# EAGLE design bleumaus-oshchip-mk-1.0.0 (EAGLE 9.3.1)
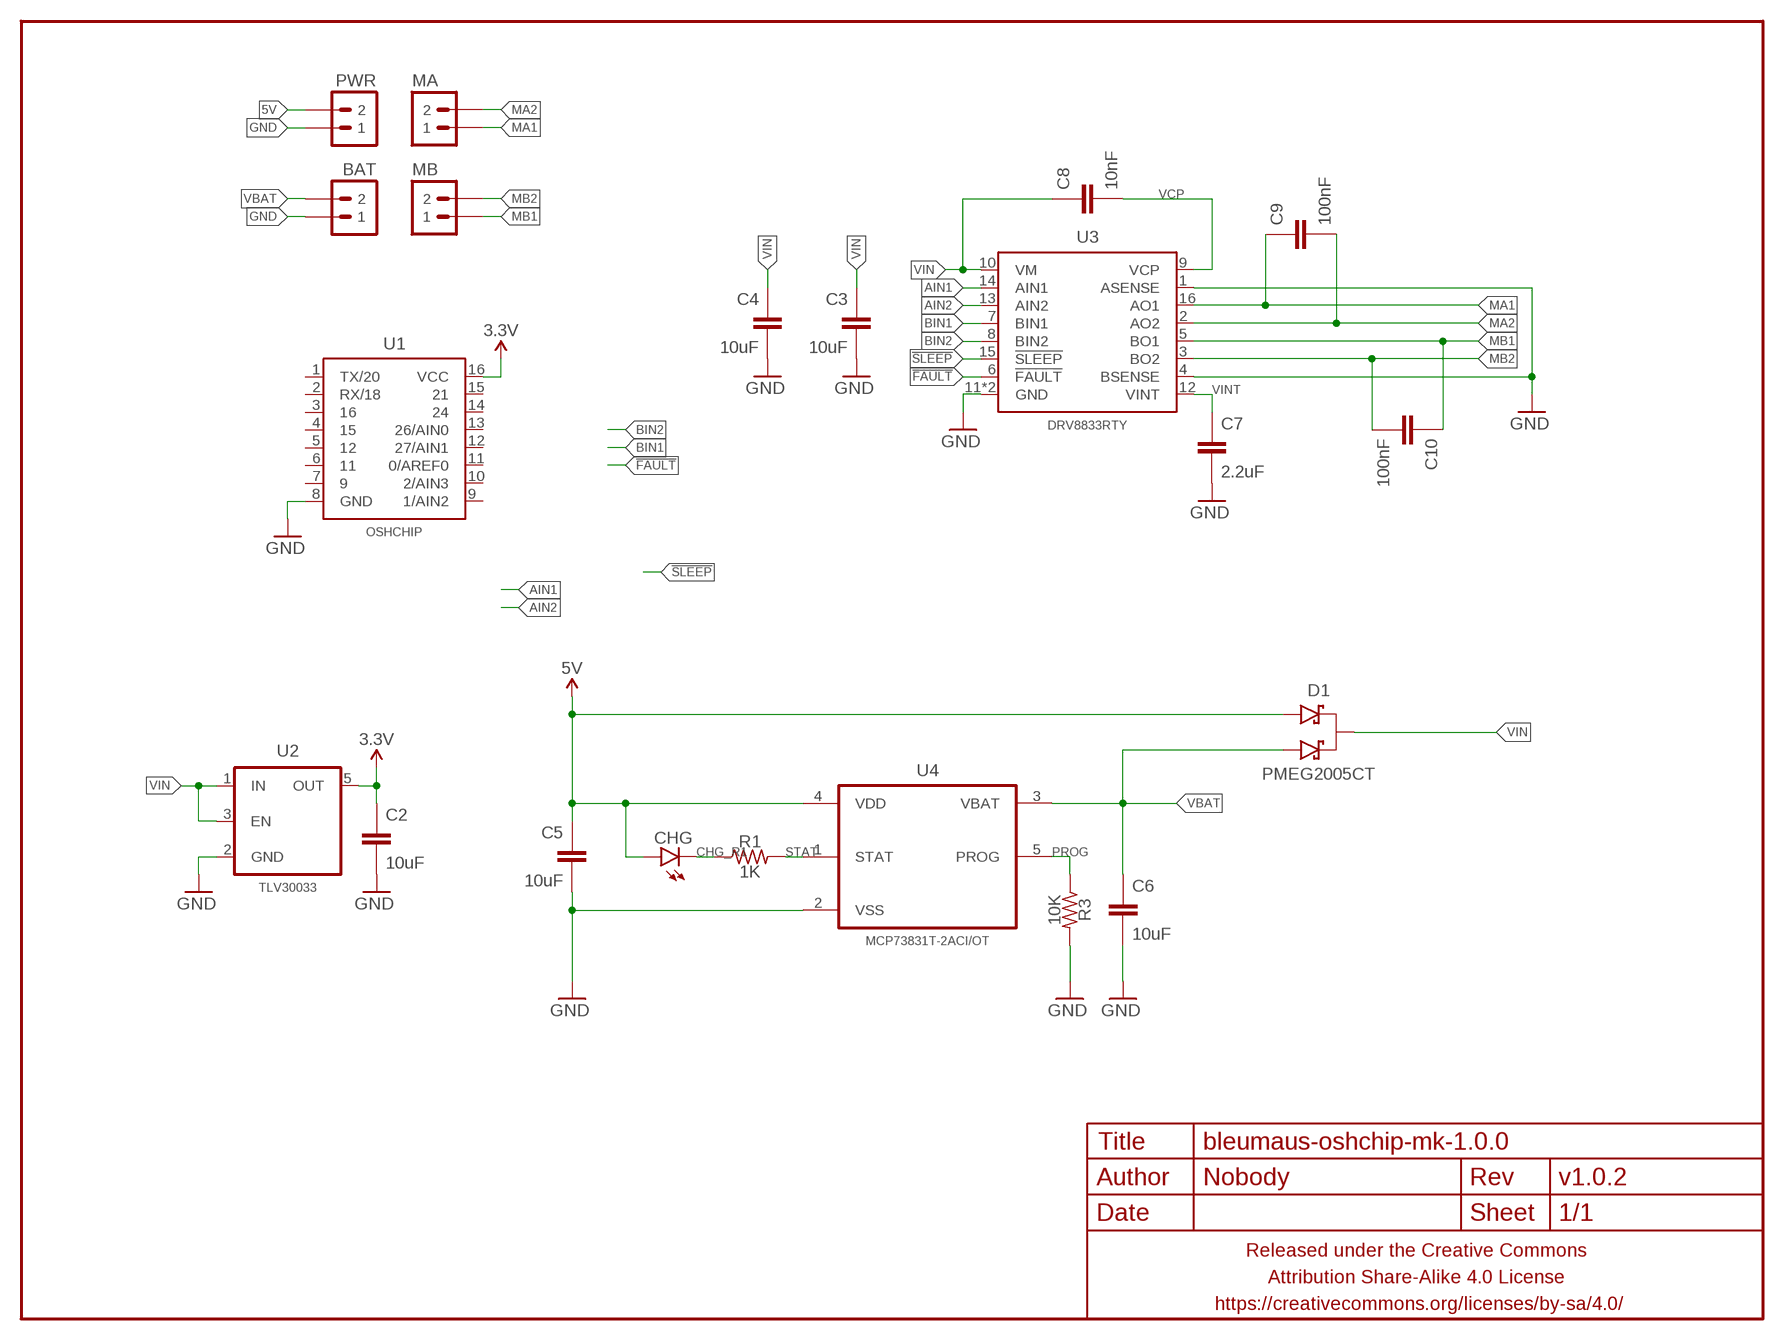
[diagram p0: schematic, sheet 1]

## Parts
BAT  M02PTH-2MM  [1X02-2MM-PTH]
C2  10uF  CAPACITOR-CERAMICC0402  [C0402]
C3  10uF  CAPACITOR-CERAMICC1206  [C1206]
C4  10uF  CAPACITOR-CERAMICC1206  [C1206]
C5  10uF  CAPACITOR-CERAMICC0402  [C0402]
C6  10uF  CAPACITOR-CERAMICC0402  [C0402]
C7  2.2uF  CAPACITOR-CERAMICC0402  [C0402]
C8  10nF  CAPACITOR-CERAMICC0402  [C0402]
C9  100nF  CAPACITOR-CERAMICC0402  [C0402]
C10  100nF  CAPACITOR-CERAMICC0402  [C0402]
CHG  LED0603-TIGHT  [LED-0603-TIGHT]
D1  PMEG2005CT  DIODE-SCHOTTKY-DUALPMEG2005CT  [SOT23]
FRAME1  FRAME-LETTERNO_PACKAGE  [DUMMY]
MA  M02PTH-2MM  [1X02-2MM-PTH]
MB  M02PTH-2MM  [1X02-2MM-PTH]
PWR  M02PTH-2MM  [1X02-2MM-PTH]
R1  1K  RESISTORR0402  [R0402]
R3  10K  RESISTORR0402  [R0402]
U1  OSHCHIP  [DIL16]
U2  TLV30033  V_REG_ENTLV700XXDCK-TIGHTER  [SC70-TIGHTER]
U3  DRV8833RTY  [PWQFN-16]
U4  MCP73831T-2ACI/OT  [SOT95P280X145-5N]

## Nets
3.3V: C2.1 U1.16(VCC) U2.5(OUT)
5V: C5.1 CHG.A D1.1(A1) PWR.P$2 U4.4(VDD)
!FAULT: U3.6(!FAULT)
!SLEEP: U3.15(!SLEEP)
AIN1: U3.14(AIN1)
AIN2: U3.13(AIN2)
BIN1: U3.7(BIN1)
BIN2: U3.8(BIN2)
CHG_R1: CHG.C R1.1
GND: BAT.P$1 C2.2 C3.2 C4.2 C5.2 C6.2 C7.2 PWR.P$1 R3.2 U1.8(GND) U2.2(GND) U3.1(ASENSE) U3.4(BSENSE) U3.11(GND) U3.17(GND) U4.2(VSS)
MA1: C9.1 MA.P$1 U3.16(AO1)
MA2: C9.2 MA.P$2 U3.2(AO2)
MB1: C10.1 MB.P$1 U3.5(BO1)
MB2: C10.2 MB.P$2 U3.3(BO2)
PROG: R3.1 U4.5(PROG)
STAT: R1.2 U4.1(STAT)
VBAT: BAT.P$2 C6.1 D1.2(A2) U4.3(VBAT)
VCP: C8.2 U3.9(VCP)
VIN: C3.1 C4.1 C8.1 D1.3(K) U2.1(IN) U2.3(EN) U3.10(VM)
VINT: C7.1 U3.12(VINT)
Unconnected: U1.1(TX/20) U1.2(RX/18) U1.3 U1.4 U1.5 U1.6 U1.7 U1.9(1/AIN2) U1.10(2/AIN3) U1.11(0/AREF0) U1.12(27/AIN1) U1.13(26/AIN0) U1.14 U1.15

## Library data of the parts
BAT MA MB PWR = a_parts:M02: Standard 2-pin 0.1" header. Use with - straight break away headers ( PRT-00116) - right angle break away headers (PRT-00553) - swiss pins (PRT-00743) - machine pins (PRT-00117) - female headers (PRT-00115) Molex polarized connector foot print use with: PRT-08233 with associated crimp pins and housings. 2.54_SCREWTERM for use with PRT-10571. 3.5mm Screw Terminal footprints for PRT-08084 5mm Screw Terminal footprints for use with PRT-08433
C2-C10 = a_parts:CAPACITOR-CERAMIC: CAPACITOR, European symbol
CHG = a_parts:LED: LEDs Standard schematic elements and footprints for 5mm, 3mm, 1206, and 0603 sized LEDs. 5mm - Spark Fun Electronics SKU : COM-00529 (and others)
D1 = a_parts:DIODE-SCHOTTKY-DUAL
FRAME1 = a_parts:FRAME-LETTER: Schematic Frame Standard 8.5x11 US Letter frame; DESIGNER: Nobody; VERSION: v1.0.2
R1 R3 = a_parts:RESISTOR: RESISTOR, American symbol
U1 = a_parts:OSHCHIP
U2 = a_parts:V_REG_EN
U3 = a_parts:DRV8833
U4 = a_parts:MCP73831T-2ACI/OT: Charge Management Controller; MPN: MCP73831T-2ACI/OT; OC_FARNELL: 1332158; OC_NEWARK: 56K7045; PACKAGE: SOT-5; SUPPLIER: Microchip

## Board
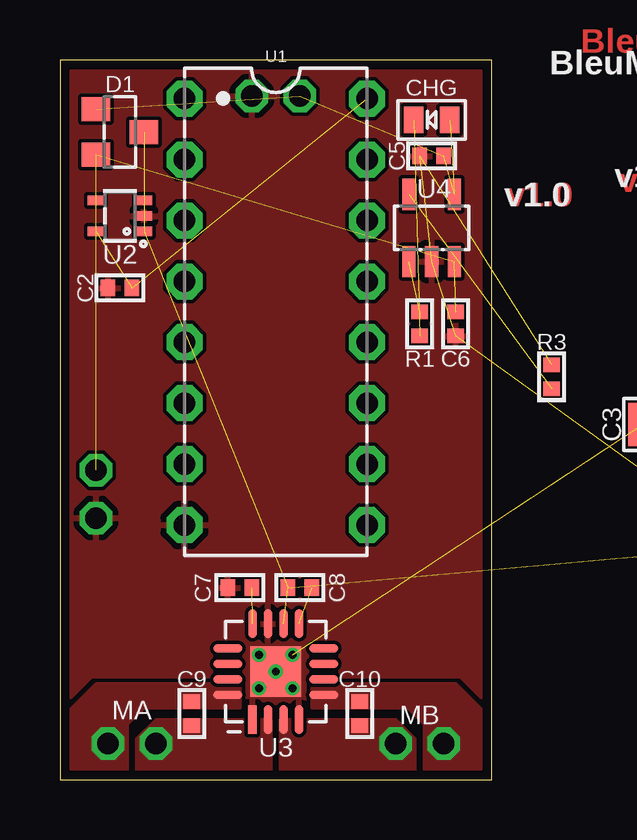
[diagram p1: board, top side]
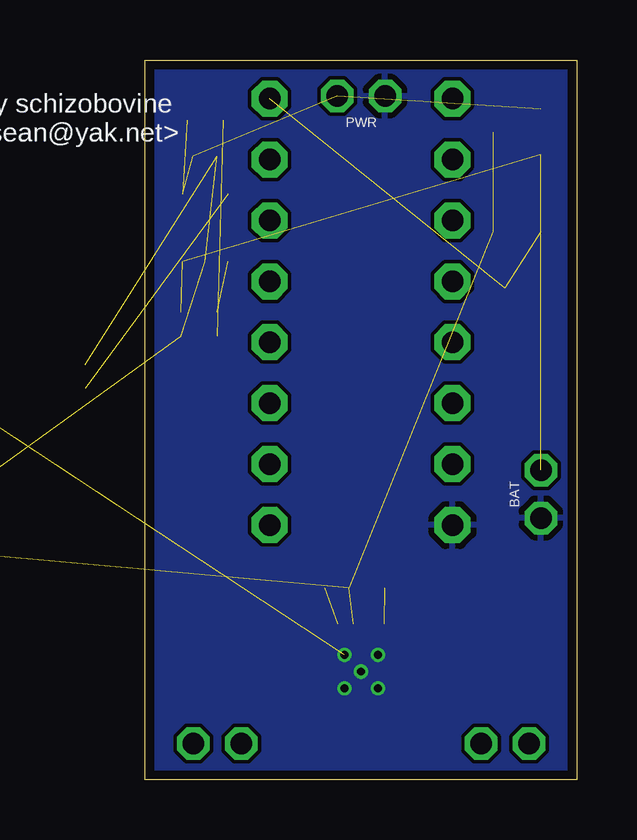
[diagram p2: board, bottom side, seen from below]

Size 18 x 30 mm. Coordinates in mm from the lower left corner, seen from the top.
Outline: 0,30 0,0 18,0 18,30 0,30
Copper layers (1*16): Top 0.035559375mm / dielectric 1.6mm / Bottom 0.035559375mm
Design rules "oshpark-2layer": minimum track width 6mil, minimum drill 10mil, track to track 6mil, track to pad 6mil, pad to pad 6mil, via to via 6mil, smd to smd 0mil, copper to edge 15mil, drill to drill 6mil, minimum pad ring 5mil, minimum via ring 5mil, stop-mask expansion 2.5mil, vias tented up to drill 20mil, thermal gap 10mil

### Footprints (pad centres in the part's own frame; a part is rotated, then mirrored left to right if it is on the bottom)
1X02-2MM-PTH = drill 0.9 octagon: P$1 -1,0; P$2 1,0
C0402 = smd 0.6 x 0.7: 1 -0.5,0; 2 0.5,0
C1206 = smd 1.2 x 1.8: 1 -1.4,0; 2 1.4,0
LED-0603-TIGHT = smd 0.8 x 1.1: A 0.75,0; C -0.75,0
SOT23 = smd 1 x 1.2: 1 -0.95,-1; 2 0.95,-1; 3 0,1
R0402 = smd 0.6 x 0.7: 1 -0.5,0; 2 0.5,0
DIL16 = drill 0.9 pad 1.5 octagon: 1 -8.89,-3.81; 2 -6.35,-3.81; 3 -3.81,-3.81; 4 -1.27,-3.81; 5 1.27,-3.81; 6 3.81,-3.81; 7 6.35,-3.81; 8 8.89,-3.81; 9 8.89,3.81; 10 6.35,3.81; 11 3.81,3.81; 12 1.27,3.81; 13 -1.27,3.81; 14 -3.81,3.81; 15 -6.35,3.81; 16 -8.89,3.81
SC70-TIGHTER = smd 0.4 x 0.7: 1 -0.65,-1; 2 0,-1; 3 0.65,-1; 4 0.65,1; 5 -0.65,1
PWQFN-16 = smd 0.35 x 1.2: 1 -0.975,-2; 2 -0.325,-2; 3 0.325,-2; 4 0.975,-2; 9 0.975,2; 10 0.325,2; 11 -0.325,2; 12 -0.975,2 | smd 1.2 x 0.35: 5 2,-0.975; 6 2,-0.325; 7 2,0.325; 8 2,0.975; 13 -2,0.975; 14 -2,0.325; 15 -2,-0.325; 16 -2,-0.975 | smd 2.1 x 2.1: 17 0,0
SOT95P280X145-5N = smd 1.3 x 0.55: 1 -1.4,0.95; 2 -1.4,0; 3 -1.4,-0.95; 4 1.4,-0.95; 5 1.4,0.95

### Placement (x,y rotation side)
BAT  1.5,11.9 90 bottom
C2  2.5,20.5 180 top
C3  25.7,14.8 180 top  (outside the outline)
C4  27.6,9.5 0 top  (outside the outline)
C5  15.5,26 180 top
C6  16.5,19 270 top
C7  7.5,8 180 top
C8  10,8 0 top
C9  5.5,2.75 270 top
C10  12.5,2.75 270 top
CHG  15.5,27.5 0 top
D1  2.5,27 270 top
FRAME1  0,0 0 top
MA  3,1.5 0 top
MB  15,1.5 180 top
PWR  9,28.5 180 bottom
R1  15,19 90 top
R3  20.5,16.8 90 top
U1  9,19.5 270 top
U2  2.5,23.5 90 top
U3  9,4.5 0 top
U4  15.5,23 90 top

### Tracks (layer width: path | path; a pad name or v marks a point on that pad's centre or on a via)
3.3V  (2 unrouted)
5V  (4 unrouted)
CHG_R1  (1 unrouted)
GND  (via drill 0.33)  (6 unrouted)
  other vias: 9,4.5 8.3,3.8 9.7,3.8 8.3,5.2 9.7,5.2
  pour Top (rank 6): 0,30 0,0 18,0 18,30
  pour Bottom (rank 6): 0,30 0,0 18,0 18,30
MA1
  pour Top (rank 2, no thermals): 0,0 2.8,0 2.8,2.3 3.5,3 7.5,3 7.5,4 1.5,4 0,2.5
MA2
  pour Top (no thermals): 3.2,1.7 3.2,0 8.8,0 8.8,2.5 4,2.5
MB1
  pour Top (rank 2, no thermals): 15.2,0 15.2,2.3 14.5,3 10.5,3 10.5,4 16.5,4 18,2.5 18,0
MB2
  pour Top (no thermals): 9.2,2.5 9.2,0 14.8,0 14.8,1.7 14,2.5
PROG  (1 unrouted)
STAT  (1 unrouted)
VBAT  (3 unrouted)
VCP  (1 unrouted)
VIN  (6 unrouted)
VINT  (1 unrouted)

### Text on the board
Top: BleuMaus
tPlace: BleuMaus
bPlace: by schizobovine / <sean@yak.net>